# Altium schematic sheet Stamp-P4.SchDoc
size A4
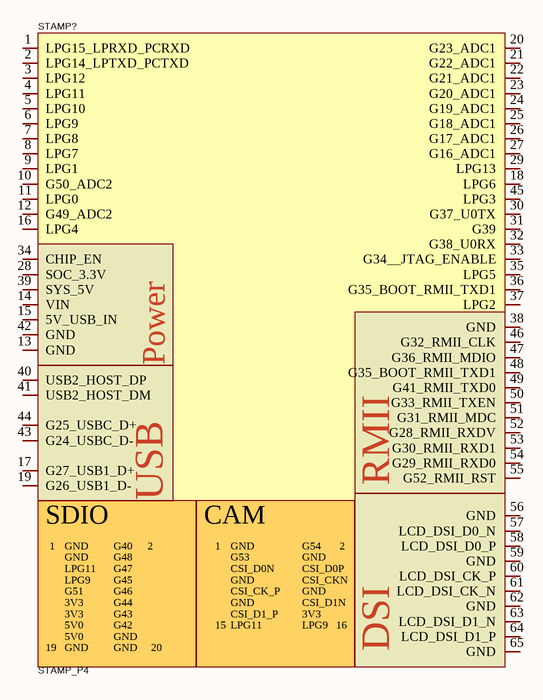
[diagram p0: Stamp-P4.SchDoc]

## Parts
STAMP?  STAMP_P4  [StampP4]

## Nets

Not connected (* = marked no-connect by the designer): STAMP? 1(LPG15_LPRXD_PCRXD) 2(LPG14_LPTXD_PCTXD) 3(LPG12) 4(LPG11) 5(LPG10) 6(LPG9) 7(LPG8) 8(LPG7) 9(LPG1) 10(G50_ADC2) 11(LPG0) 12(G49_ADC2) 13(GND) 14(VIN) 15(5V_USB_IN) 16(LPG4) 17(G27_USB1_D+) 18(LPG6) 19(G26_USB1_D-) 20(G23_ADC1) 21(G22_ADC1) 22(G21_ADC1) 23(G20_ADC1) 24(G19_ADC1) 25(G18_ADC1) 26(G17_ADC1) 27(G16_ADC1) 28(SOC_3.3V) 29(LPG13) 30(G37_U0TX) 31(G39) 32(G38_U0RX) 33(G34__JTAG_ENABLE) 34(CHIP_EN) 35(LPG5) 36(G35_BOOT_RMII_TXD1) 37(LPG2) 38(GND) 39(SYS_5V) 40(USB2_HOST_DP) 41(USB2_HOST_DM) 42(GND) 43(G24_USBC_D-) 44(G25_USBC_D+) 45(LPG3) 46(G32_RMII_CLK) 47(G36_RMII_MDIO) 48(G35_BOOT_RMII_TXD1) 49(G41_RMII_TXD0) 50(G33_RMII_TXEN) 51(G31_RMII_MDC) 52(G28_RMII_RXDV) 53(G30_RMII_RXD1) 54(G29_RMII_RXD0) 55(G52_RMII_RST) 56(GND) 57(LCD_DSI_D0_N) 58(LCD_DSI_D0_P) 59(GND) 60(LCD_DSI_CK_P) 61(LCD_DSI_CK_N) 62(GND) 63(LCD_DSI_D1_N) 64(LCD_DSI_D1_P) 65(GND)

## Notes on the sheet
- (in symbol StampP4) Power; RMII; USB; SDIO; CAM; G40; G54; G48; G53; G47; CSI_D0N; CSI_D0P; G45; CSI_CKN; G51; G46; CSI_CK_P; 3V3; G44; CSI_D1N; G43; CSI_D1_P; 5V0; G42; DSI

## Library data of the parts
STAMP? = StampP4: Manufacturer: ESPRESSIF(乐鑫); Manufacturer Part: ESP32-P4NRW32; Symbol: ESP32-P4NRW32_C22387510; Add into BOM: yes; Device: ESP32-P4NRW32_C22387510; LCSC Part Name: ESP32-P4NRW32; Supplier Part: C22387510; Supplier Footprint: QFN-104(10x10); JLCPCB Part Class: Extended Part; Datasheet: https://atta.szlcsc.com/upload/public/pdf/source/20240809/B078A3F5F7FA78742834A9F44EEEC69A.pdf; Supplier: LCSC; Convert to PCB: yes